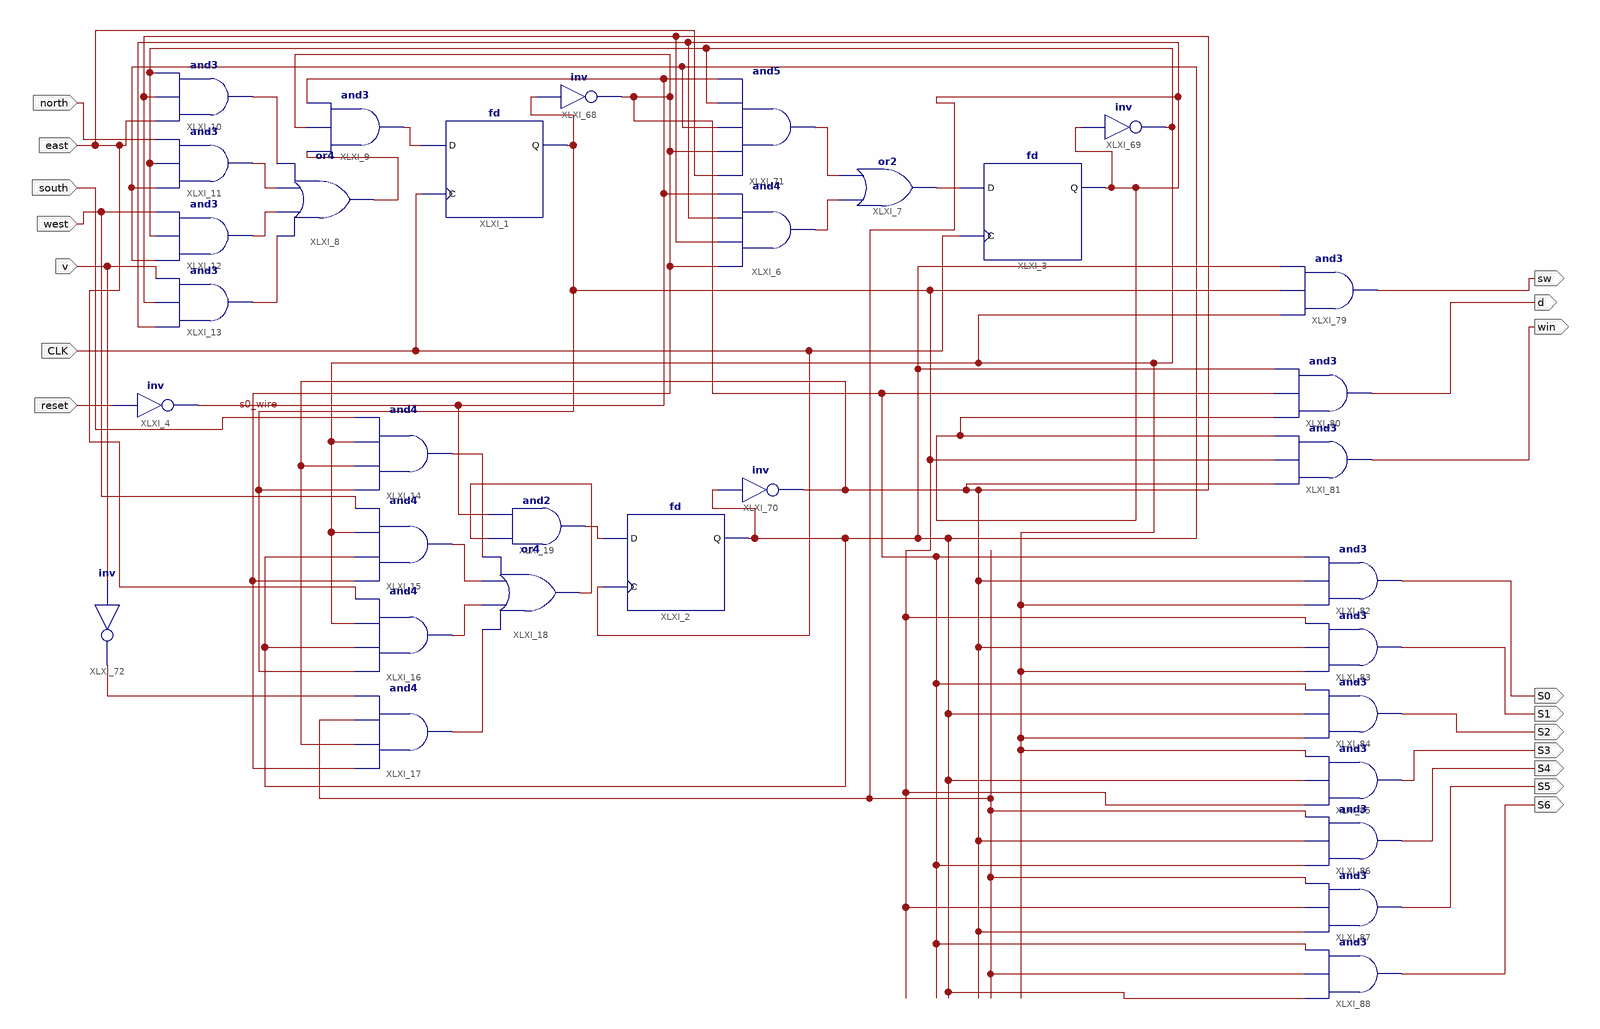
[diagram p0: schematic sheet 1]
// Xilinx ISE schematic ECE281Celiano_Lab2_room.sch (spartan3e) as structural Verilog: 33 symbols, 17 ports
module ECE281Celiano_Lab2_room (
  input  CLK,
  input  v,
  input  west,
  input  south,
  input  east,
  input  reset,
  input  north,
  output sw,
  output d,
  output win,
  output S6,
  output S2,
  output S1,
  output S5,
  output S4,
  output S0,
  output S3
);

  wire reset_not, S0_not, s0_wire, S1_not, s1_wire, S2_not, s2_wire, XLXN_72, XLXN_74, XLXN_75, XLXN_76,
       XLXN_78, XLXN_79, XLXN_80, XLXN_81, XLXN_82, XLXN_91, XLXN_92, XLXN_93, XLXN_94, XLXN_95, XLXN_96,
       XLXN_243;

  not XLXI_4 (reset_not, reset);
  and XLXI_9 (XLXN_82, XLXN_81, S0_not, reset_not);
  fd XLXI_1 (.C(CLK), .D(XLXN_82), .Q(s0_wire));
  or XLXI_7 (XLXN_75, XLXN_72, XLXN_74);
  and XLXI_6 (XLXN_72, S0_not, S1_not, s2_wire, reset_not);
  and XLXI_17 (XLXN_92, S0_not, S1_not, s2_wire, XLXN_91);
  and XLXI_19 (XLXN_243, XLXN_96, reset_not);
  or XLXI_18 (XLXN_96, XLXN_92, XLXN_93, XLXN_94, XLXN_95);
  and XLXI_16 (XLXN_93, s0_wire, s1_wire, S2_not, east);
  and XLXI_15 (XLXN_94, S0_not, s1_wire, S2_not, west);
  and XLXI_14 (XLXN_95, s0_wire, S1_not, S2_not, south);
  fd XLXI_2 (.C(CLK), .D(XLXN_243), .Q(s1_wire));
  not XLXI_68 (S0_not, s0_wire);
  not XLXI_69 (S2_not, s2_wire);
  not XLXI_70 (S1_not, s1_wire);
  fd XLXI_3 (.C(CLK), .D(XLXN_75), .Q(s2_wire));
  and XLXI_71 (XLXN_74, east, S0_not, s1_wire, S2_not, reset_not);
  not XLXI_72 (XLXN_91, v);
  or XLXI_8 (XLXN_81, XLXN_80, XLXN_79, XLXN_78, XLXN_76);
  and XLXI_10 (XLXN_76, east, S1_not, S2_not);
  and XLXI_11 (XLXN_78, s1_wire, S2_not, north);
  and XLXI_13 (XLXN_80, s2_wire, S1_not, v);
  and XLXI_12 (XLXN_79, s1_wire, S2_not, west);
  and XLXI_79 (sw, S2_not, s0_wire, s1_wire);
  and XLXI_80 (d, s2_wire, S0_not, s1_wire);
  and XLXI_81 (win, S1_not, s0_wire, s2_wire);
  and XLXI_88 (S6, s1_wire, s2_wire, S0_not);
  and XLXI_82 (S0, S2_not, S1_not, S0_not);
  and XLXI_83 (S1, S2_not, S1_not, s0_wire);
  and XLXI_84 (S2, S2_not, s1_wire, S0_not);
  and XLXI_85 (S3, s0_wire, s1_wire, S2_not);
  and XLXI_86 (S4, S0_not, S1_not, s2_wire);
  and XLXI_87 (S5, S1_not, s0_wire, s2_wire);
endmodule
